# EAGLE design NewWiring (EAGLE 7.7.0)
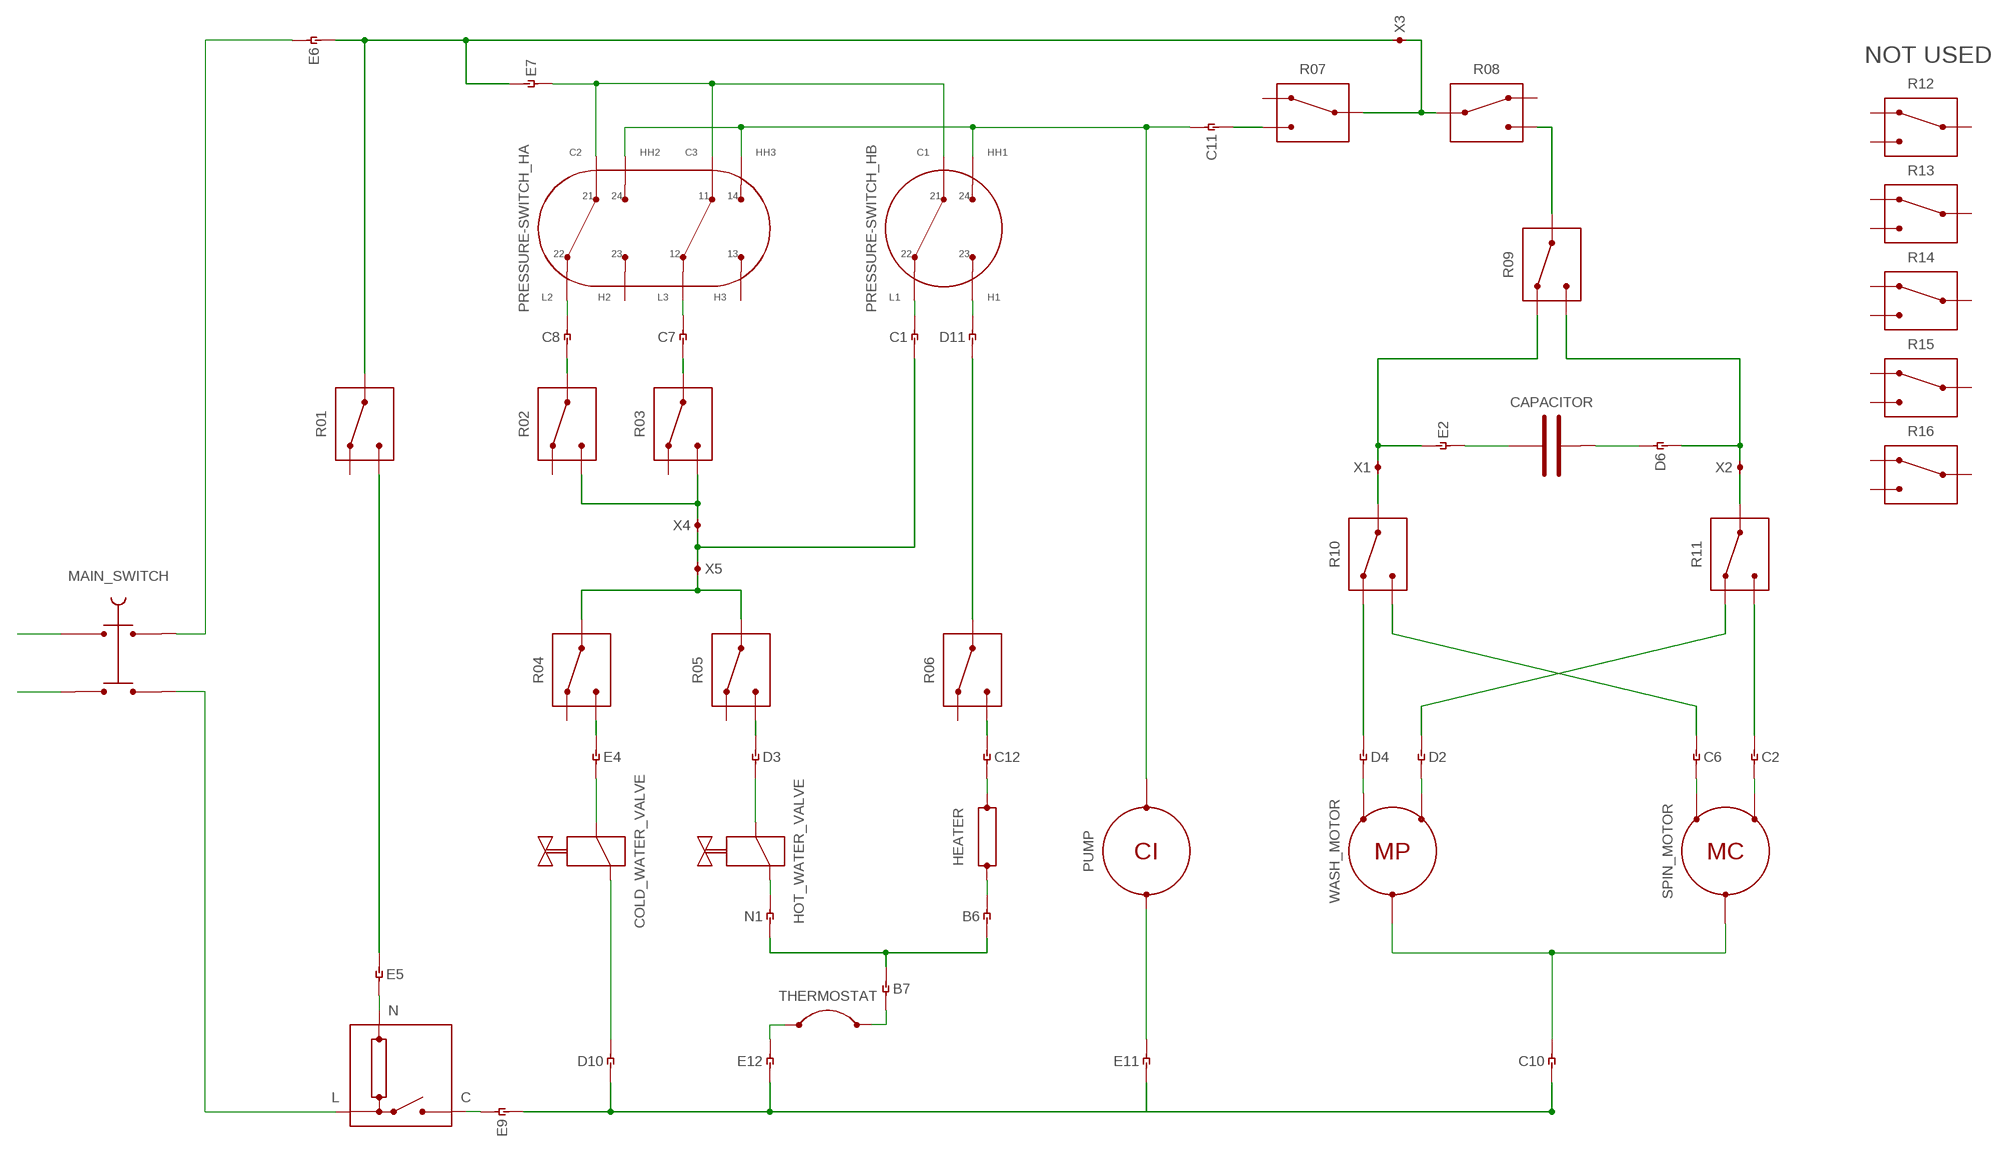
[diagram p0: schematic, sheet 1]

## Parts
B6  CABLE  [CABLE]
B7  CABLE  [CABLE]
C1  CABLE  [CABLE]
C2  CABLE  [CABLE]
C6  CABLE  [CABLE]
C7  CABLE  [CABLE]
C8  CABLE  [CABLE]
C10  CABLE  [CABLE]
C11  CABLE  [CABLE]
C12  CABLE  [CABLE]
CAPACITOR  CAPACITOR  [CAPACITOR]
COLD_WATER_VALVE  VALVE  [VALVE]
D2  CABLE  [CABLE]
D3  CABLE  [CABLE]
D4  CABLE  [CABLE]
D6  CABLE  [CABLE]
D10  CABLE  [CABLE]
D11  CABLE  [CABLE]
E2  CABLE  [CABLE]
E4  CABLE  [CABLE]
E5  CABLE  [CABLE]
E6  CABLE  [CABLE]
E7  CABLE  [CABLE]
E9  CABLE  [CABLE]
E11  CABLE  [CABLE]
E12  CABLE  [CABLE]
HEATER  HEATER  [HEATER]
HOT_WATER_VALVE  VALVE  [VALVE]
MAIN_SWITCH  SWITCH  [SWITCH]
N1  CABLE  [CABLE]
PRESSURE-SWITCH_HA  PS2  [PS2]
PRESSURE-SWITCH_HB  PS1  [PS1]
PUMP  CI  MOTOR-2  [MOTOR-2]
R01  RELAY  [RELAY]
R02  RELAY  [RELAY]
R03  RELAY  [RELAY]
R04  RELAY  [RELAY]
R05  RELAY  [RELAY]
R06  RELAY  [RELAY]
R07  RELAY  [RELAY]
R08  RELAY  [RELAY]
R09  RELAY  [RELAY]
R10  RELAY  [RELAY]
R11  RELAY  [RELAY]
R12  RELAY  [RELAY]
R13  RELAY  [RELAY]
R14  RELAY  [RELAY]
R15  RELAY  [RELAY]
R16  RELAY  [RELAY]
SPIN_MOTOR  MC  MOTOR-3  [MOTOR-3]
THERMOSTAT  THERMOSTAT  [THERMOSTAT]
U$1  LOCK  [LOCK]
WASH_MOTOR  MP  MOTOR-3  [MOTOR-3]
X1  DOMINO  [DOMINO]
X2  DOMINO  [DOMINO]
X3  DOMINO  [DOMINO]
X4  DOMINO  [DOMINO]
X5  DOMINO  [DOMINO]

## Nets
C1: C1.P$2(PIN2) PRESSURE-SWITCH_HB.P$3
C10: C10.P$2(PIN2) SPIN_MOTOR.MC WASH_MOTOR.MC
C11-OVERFLOW: C11.P$2(PIN2) PRESSURE-SWITCH_HA.P$5 PRESSURE-SWITCH_HA.P$8 PRESSURE-SWITCH_HB.P$2 PUMP.M1
D2: D2.P$2(PIN2) WASH_MOTOR.M3(M2)
D4: D4.P$2(PIN2) WASH_MOTOR.M1
D6: CAPACITOR.C2 D6.P$2(PIN2)
D10: COLD_WATER_VALVE.P$1 D10.P$2(PIN2)
D11: D11.P$2(PIN2) PRESSURE-SWITCH_HB.P$4
E5: E5.P$2(PIN2) U$1.N
E11: E11.P$2(PIN2) PUMP.M3(M2)
LIVE: C10.P$1(PIN1) D10.P$1(PIN1) E9.P$1(PIN1) E11.P$1(PIN1) E12.P$1(PIN1)
N$1: E6.P$2(PIN2) MAIN_SWITCH.O1(OUT1)
N$2: COLD_WATER_VALVE.P$2 E4.P$2(PIN2)
N$3: MAIN_SWITCH.O2(OUT2) U$1.L
N$4: D3.P$2(PIN2) HOT_WATER_VALVE.P$2
N$5: B6.P$1(PIN1) B7.P$1(PIN1) N1.P$1(PIN1)
N$6: E5.P$1(PIN1) R01.T
N$7: D4.P$1(PIN1) R10.R
N$8: MAIN_SWITCH.I1(IN1)
N$9: C2.P$1(PIN1) R11.T
N$10: MAIN_SWITCH.I2(IN2)
N$11: C6.P$1(PIN1) R10.T
N$12: R08.T R09.C
N$13: HOT_WATER_VALVE.P$1 N1.P$2(PIN2)
N$14: D2.P$1(PIN1) R11.R
N$15: R10.C X1.P$1(PIN1)
N$16: R02.T R03.T X4.P$2(PIN2)
N$17: C8.P$2(PIN2) PRESSURE-SWITCH_HA.P$2
N$18: C7.P$2(PIN2) PRESSURE-SWITCH_HA.P$6
N$19: C6.P$2(PIN2) SPIN_MOTOR.M1
N$20: E9.P$2(PIN2) U$1.C
N$21: C12.P$2(PIN2) HEATER.H2
N$22: E12.P$2(PIN2) THERMOSTAT.T2
N$23: C12.P$1(PIN1) R06.T
N$24: C11.P$1(PIN1) R07.T
N$25: D3.P$1(PIN1) R05.T
N$26: C2.P$2(PIN2) SPIN_MOTOR.M3(M2)
N$27: E2.P$1(PIN1) R09.R X1.P$2(PIN2)
N$28: B7.P$2(PIN2) THERMOSTAT.T1
N$29: B6.P$2(PIN2) HEATER.H1
N$30: D6.P$1(PIN1) R09.T X2.P$2(PIN2)
N$31: R11.C X2.P$1(PIN1)
N$32: R07.C R08.C X3.P$2(PIN2)
N$33 [Cable]: CAPACITOR.C1 E2.P$2(PIN2)
N$35: R04.C R05.C X5.P$2(PIN2)
N$39: E7.P$2(PIN2) PRESSURE-SWITCH_HA.P$1 PRESSURE-SWITCH_HA.P$4 PRESSURE-SWITCH_HB.P$1
N$42: C8.P$1(PIN1) R02.C
N$43: C7.P$1(PIN1) R03.C
N$45: D11.P$1(PIN1) R06.C
N$47: E4.P$1(PIN1) R04.T
NEUTRAL: E6.P$1(PIN1) E7.P$1(PIN1) R01.C X3.P$1(PIN1)
PHASE3: C1.P$1(PIN1) X4.P$1(PIN1) X5.P$1(PIN1)
Unconnected: PRESSURE-SWITCH_HA.P$3 PRESSURE-SWITCH_HA.P$7 R01.R R02.R R03.R R04.R R05.R R06.R R07.R R08.R R12.C R12.R R12.T R13.C R13.R R13.T R14.C R14.R R14.T R15.C R15.R R15.T R16.C R16.R R16.T

## Notes on the sheet
- NOT USED

## Library data of the parts
B6 B7 C1 C2 C6-C8 C10-C12 D2-D4 D6 D10 D11 E2 E4-E7 E9 E11 E12 N1 = Kostas:CABLE: CABLE CONNECTION MALE ON PCB FEMALE ON CABLE SIDE
CAPACITOR = Kostas:CAPACITOR
COLD_WATER_VALVE HOT_WATER_VALVE = Kostas:VALVE: Electrovalve
HEATER = Kostas:HEATER: HEATER
MAIN_SWITCH = Kostas:SWITCH: POWER SWITCH
PRESSURE-SWITCH_HA = Kostas:PS2: PRESSURE SWITCH - DOUBLE
PRESSURE-SWITCH_HB = Kostas:PS1: PRESSURE SWITCH - SIMPLE
PUMP = Kostas:MOTOR-2: MOTOR 2 PHASES
R01-R09 R10-R16 = Kostas:RELAY: RELAY
SPIN_MOTOR WASH_MOTOR = Kostas:MOTOR-3
THERMOSTAT = Kostas:THERMOSTAT: THERMOSTAT
U$1 = Kostas:LOCK: DOOR LOCK
X1-X5 = Kostas:DOMINO: DOMINO

## Board
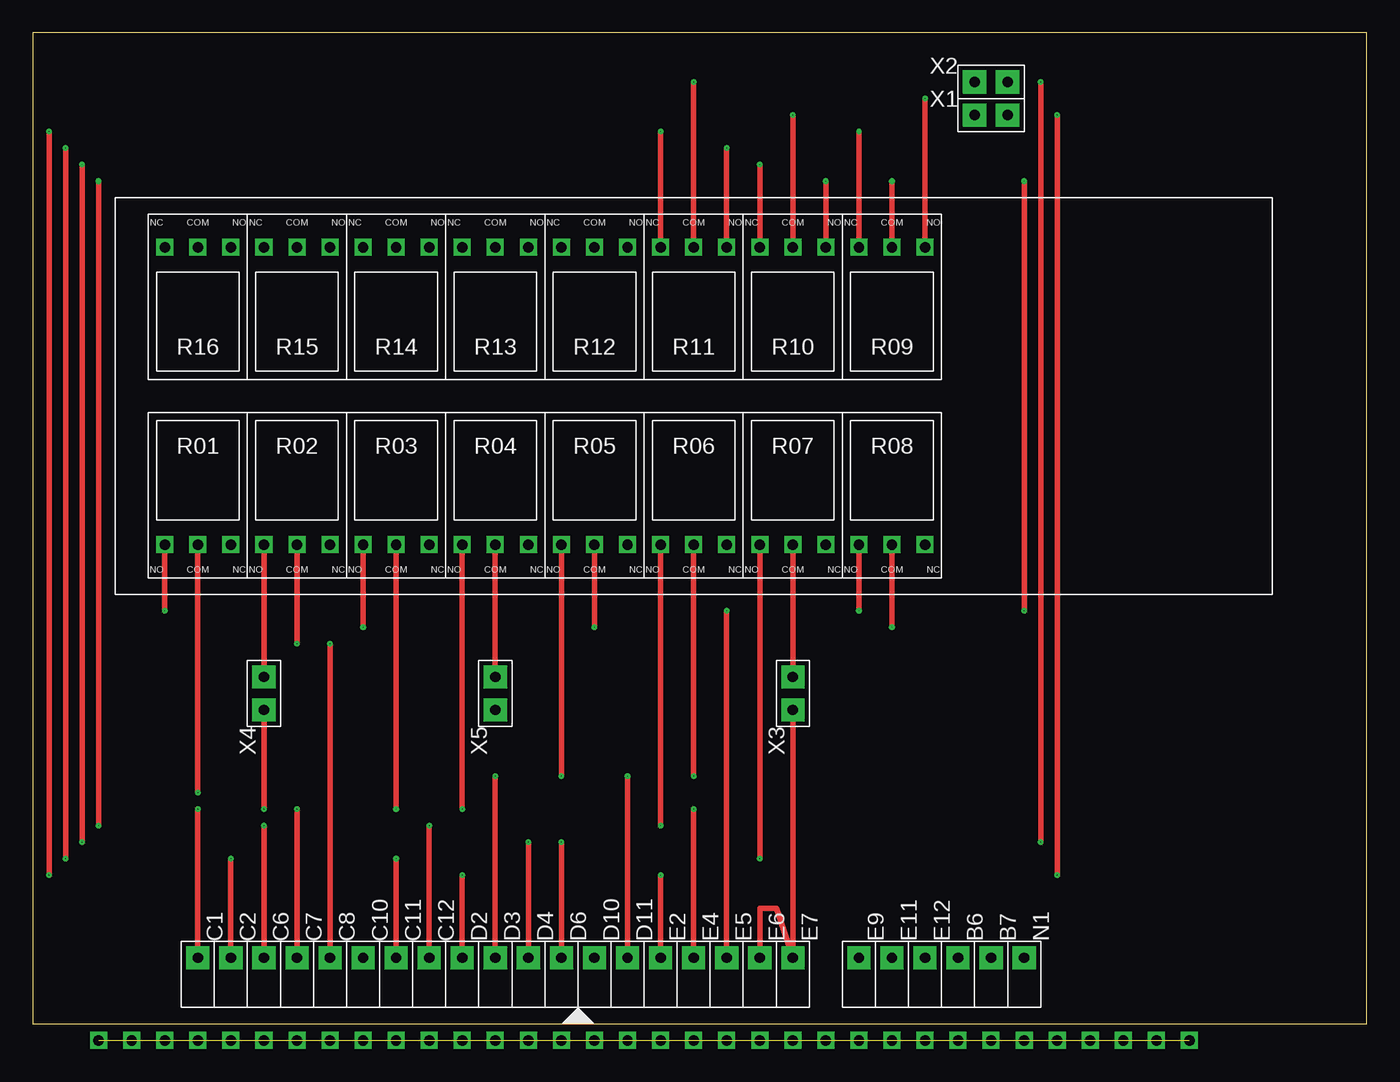
[diagram p1: board, top side]
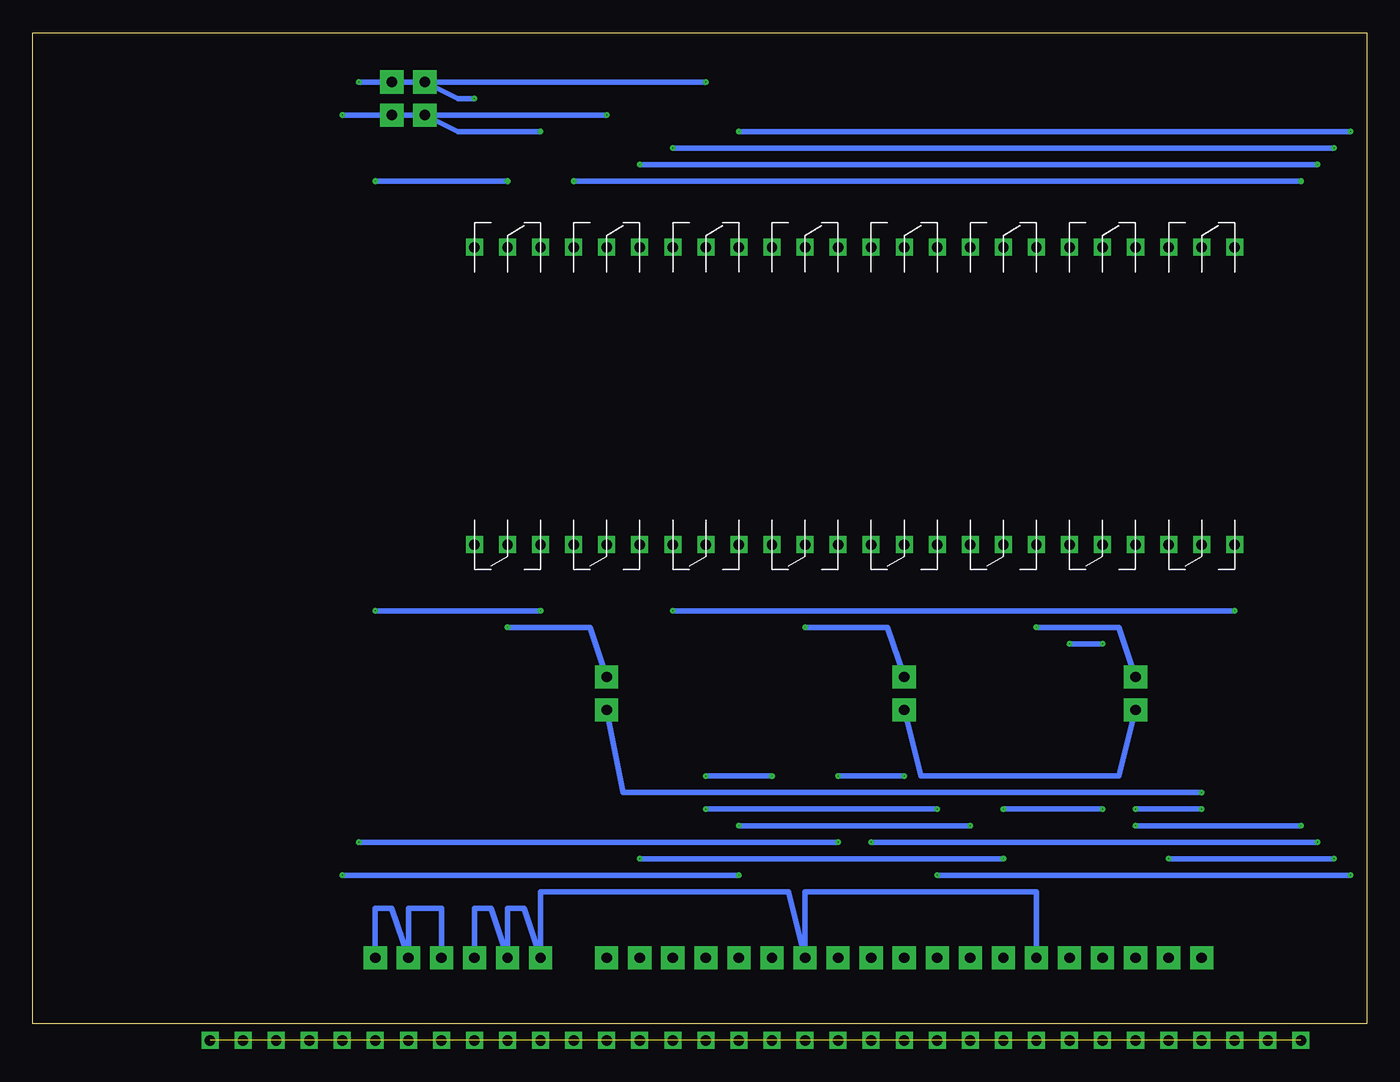
[diagram p2: board, bottom side, seen from below]

Size 102.54 x 76.19 mm. Coordinates in mm from the lower left corner, seen from the top.
Outline: 0,0 102.54,0 102.54,76.19 0,76.19 0,0
Copper layers (1*16): Top 0.035mm / dielectric 1.5mm / Bottom 0.035mm
Design rules "default": minimum track width 10mil, minimum drill 24mil, track to track 8mil, track to pad 8mil, pad to pad 8mil, via to via 8mil, smd to smd 8mil, copper to edge 40mil, drill to drill 8mil, minimum pad ring 10mil, minimum via ring 8mil, stop-mask expansion 4mil, vias tented up to drill 0mil, thermal gap 10mil

### Footprints (pad centres in the part's own frame; a part is rotated, then mirrored left to right if it is on the bottom)
CABLE = drill 0.8 pad 1.778 square: P$1 0,0 | drill 0.003 pad 0.254: P$2 0,-6.35
CAPACITOR = drill 0.8 square: C1 -1.27,0; C2 1.27,0
VALVE = drill 0.8 square: P$1 0,0; P$2 0,-2.54
HEATER = drill 0.8 square: H1 0,0; H2 2.54,0
SWITCH = drill 0.8 square: I1 0,0; I2 2.54,0; O1 5.08,0; O2 7.62,0
PS2 = drill 0.8 square: P$1 0,0; P$2 0,-2.54; P$3 0,-5.08; P$4 0,-7.62; P$5 0,-10.16; P$6 0,-12.7; P$7 0,-15.24; P$8 0,-17.78
PS1 = drill 0.8 square: P$1 0,0; P$2 0,-2.54; P$3 0,-5.08; P$4 0,-7.62
MOTOR-2 = drill 0.8 square: M1 0,0; M3 2.54,0
RELAY = drill 0.8 square: C -1.27,0; R -1.27,2.54; T -1.27,-2.54
MOTOR-3 = drill 0.8 square: M1 -2.54,0; M3 2.54,0; MC 0,0
THERMOSTAT = drill 0.8 square: T1 0,0; T2 2.54,0
LOCK = drill 0.8 square: C 5.08,0; L 0,0; N 2.54,0
DOMINO = drill 0.8 pad 1.778 square: P$1 0,0; P$2 0,-2.54

### Placement (x,y rotation side)
B6  71.12,5.08 0 top
B7  73.66,5.08 0 top
C1  12.7,5.08 0 top
C2  15.24,5.08 0 top
C6  17.78,5.08 0 top
C7  20.32,5.08 0 top
C8  22.86,5.08 0 top
C10  25.4,5.08 0 top
C11  27.94,5.08 0 top
C12  30.48,5.08 0 top
CAPACITOR  41.91,-1.27 180 top
COLD_WATER_VALVE  48.26,-1.27 90 top
D2  33.02,5.08 0 top
D3  35.56,5.08 0 top
D4  38.1,5.08 0 top
D6  40.64,5.08 0 top
D10  43.18,5.08 0 top
D11  45.72,5.08 0 top
E2  48.26,5.08 0 top
E4  50.8,5.08 0 top
E5  53.34,5.08 0 top
E6  55.88,5.08 0 top
E7  58.42,5.08 0 top
E9  63.5,5.08 0 top
E11  66.04,5.08 0 top
E12  68.58,5.08 0 top
HEATER  27.94,-1.27 0 top
HOT_WATER_VALVE  22.86,-1.27 90 top
MAIN_SWITCH  45.72,-1.27 0 top
N1  76.2,5.08 0 top
PRESSURE-SWITCH_HA  88.9,-1.27 270 top
PRESSURE-SWITCH_HB  12.7,-1.27 270 top
PUMP  66.04,-1.27 180 top
R01  12.7,35.56 270 top
R02  20.32,35.56 270 top
R03  27.94,35.56 270 top
R04  35.56,35.56 270 top
R05  43.18,35.56 270 top
R06  50.8,35.56 270 top
R07  58.42,35.56 270 top
R08  66.04,35.56 270 top
R09  66.04,60.96 90 top
R10  58.42,60.96 90 top
R11  50.8,60.96 90 top
R12  43.18,60.96 90 top
R13  35.56,60.96 90 top
R14  27.94,60.96 90 top
R15  20.32,60.96 90 top
R16  12.7,60.96 90 top
SPIN_MOTOR  17.78,-1.27 180 top
THERMOSTAT  68.58,-1.27 180 top
U$1  55.88,-1.27 0 top
WASH_MOTOR  35.56,-1.27 180 top
X1  72.39,69.85 90 top
X2  72.39,72.39 90 top
X3  58.42,24.13 180 top
X4  17.78,24.13 180 top
X5  35.56,24.13 180 top

### Tracks (layer width: path | path; a pad name or v marks a point on that pad's centre or on a via)
C1  (1 unrouted)
C10  (2 unrouted)
C11-OVERFLOW  (4 unrouted)
D10  (1 unrouted)
D11  (1 unrouted)
E5  (1 unrouted)
E11  (1 unrouted)
LIVE
  Bottom 0.406: C10.P$1 25.4,10.16 43.18,10.16 D10.P$1 44.45,10.16 63.5,10.16 E9.P$1 64.77,8.89 66.04,8.89 E11.P$1 67.31,8.89 68.58,8.89 E12.P$1
N$1  (1 unrouted)
N$3  (1 unrouted)
N$4  (1 unrouted)
N$5
  Bottom 0.406: B6.P$1 71.12,8.89 73.66,8.89 B7.P$1 74.93,8.89 76.2,8.89 N1.P$1
N$6  (via drill 0.03, 0.03 pad 0.13)
  Top 0.406: R01.T v10.16,31.75 | E5.P$1 v53.34,31.75
  Bottom 0.406: v10.16,31.75 v53.34,31.75
N$7  (via drill 0.03 pad 0.13)
  Top 0.406: R10.R v55.88,66.04 | v3.81,66.04 v3.81,13.97 | v38.1,13.97 D4.P$1
  Bottom 0.406: v55.88,66.04 v3.81,66.04 | v3.81,13.97 v38.1,13.97
N$9  (via drill 0.03 pad 0.13, 0.03 pad 0.25)
  Top 0.406: v53.34,67.31 R11.T | C2.P$1 v15.24,12.7 | v2.54,12.7 v2.54,67.31
  Bottom 0.406: v2.54,67.31 v53.34,67.31 | v15.24,12.7 v2.54,12.7
N$11  (via drill 0.03, 0.03 pad 0.13)
  Top 0.406: v60.96,64.77 R10.T | C6.P$1 v17.78,15.24 | v5.08,15.24 v5.08,64.77
  Bottom 0.406: v5.08,64.77 v60.96,64.77 | v17.78,15.24 v5.08,15.24
N$12  (via drill 0.03, 0.03 pad 0.13)
  Top 0.406: R09.C v66.04,64.77 | v76.2,64.77 v76.2,31.75 | v63.5,31.75 R08.T
  Bottom 0.406: v66.04,64.77 v76.2,64.77 | v76.2,31.75 v63.5,31.75
N$13  (1 unrouted)
N$14  (via drill 0.03 pad 0.13)
  Top 0.406: R11.R v48.26,68.58 | v1.27,68.58 v1.27,11.43 | v33.02,11.43 D2.P$1
  Bottom 0.406: v48.26,68.58 v1.27,68.58 | v1.27,11.43 v33.02,11.43
N$15  (via drill 0.03)
  Top 0.406: v58.42,69.85 R10.C
  Bottom 0.406: X1.P$1 v58.42,69.85
N$16  (via drill 0.03)
  Top 0.406: R02.T X4.P$2 | R03.T v25.4,30.48
  Bottom 0.406: v25.4,30.48 19.05,30.48 X4.P$2
N$17  (1 unrouted)
N$18  (1 unrouted)
N$19  (1 unrouted)
N$20  (1 unrouted)
N$22  (1 unrouted)
N$23  (via drill 0.03)
  Top 0.406: C12.P$1 v30.48,15.24 | R06.T v48.26,15.24
  Bottom 0.406: v30.48,15.24 v48.26,15.24
N$24  (via drill 0.03)
  Top 0.406: R07.T v55.88,12.7 | C11.P$1 v27.94,12.7
  Bottom 0.406: v27.94,12.7 v55.88,12.7
N$25  (via drill 0.03)
  Top 0.406: D3.P$1 v35.56,19.05 | v40.64,19.05 R05.T
  Bottom 0.406: v35.56,19.05 v40.64,19.05
N$27  (via drill 0 pad 0.13, 0.03, 0.03 pad 0.13)
  Top 0.406: v78.74,69.85 v78.74,11.43 | E2.P$1 v48.26,11.43 | R09.R v63.5,68.58
  Bottom 0.406: v48.26,11.43 v78.74,11.43 | v78.74,69.85 X1.P$2 72.39,69.85 69.85,68.58 v63.5,68.58
N$28  (1 unrouted)
N$29  (1 unrouted)
N$30  (via drill 0.03, 0.03 pad 0.13)
  Top 0.406: v77.47,72.39 v77.47,13.97 | D6.P$1 v40.64,13.97 | R09.T v68.58,71.12
  Bottom 0.406: v40.64,13.97 v77.47,13.97 | v77.47,72.39 X2.P$2 72.39,72.39 69.85,71.12 v68.58,71.12
N$31  (via drill 0.03 pad 0.13)
  Top 0.406: R11.C v50.8,72.39
  Bottom 0.406: v50.8,72.39 X2.P$1
N$32  (via drill 0.03)
  Top 0.406: R08.C v66.04,30.48 | R07.C X3.P$2
  Bottom 0.406: v66.04,30.48 59.69,30.48 X3.P$2
N$33  (1 unrouted)
N$35  (via drill 0.03)
  Top 0.406: R05.C v43.18,30.48 | R04.C X5.P$2
  Bottom 0.406: v43.18,30.48 36.83,30.48 X5.P$2
N$39  (3 unrouted)
N$42  (via drill 0.03 pad 0.41)
  Top 0.406: C8.P$1 v22.86,29.21 | v20.32,29.21 R02.C
  Bottom 0.406: v22.86,29.21 v20.32,29.21
N$43  (via drill 0.03)
  Top 0.406: C7.P$1 v20.32,16.51 | R03.C v27.94,16.51
  Bottom 0.406: v20.32,16.51 v27.94,16.51
N$45  (via drill 0.03)
  Top 0.406: D11.P$1 v45.72,19.05 | R06.C v50.8,19.05
  Bottom 0.406: v50.8,19.05 v45.72,19.05
N$47  (via drill 0.03)
  Top 0.406: R04.T v33.02,16.51 | E4.P$1 v50.8,16.51
  Bottom 0.406: v33.02,16.51 v50.8,16.51
NEUTRAL  (via drill 0.03)
  Top 0.406: E6.P$1 55.88,8.89 57.15,8.89 E7.P$1 X3.P$1 | R01.C v12.7,17.78
  Bottom 0.406: v12.7,17.78 57.15,17.78 X3.P$1
PHASE3  (via drill 0.03)
  Top 0.406: C1.P$1 v12.7,16.51 | v17.78,16.51 X4.P$1
  Bottom 0.406: X5.P$1 34.29,19.05 19.05,19.05 X4.P$1 | v12.7,16.51 v17.78,16.51